# Altium schematic sheet A4.SchDoc
size A4; SheetNumber: ?; SheetTotal: ?
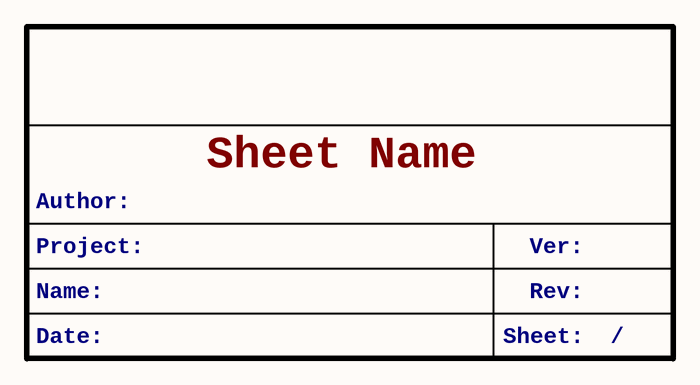
[diagram p0: A4.SchDoc]

## Notes on the sheet
- Author:
- Project:
- Sheet Name
- Ver:
- Name:
- Date:
- Sheet:
- Rev:
- /